# Altium project PCB_Project.PrjPcb
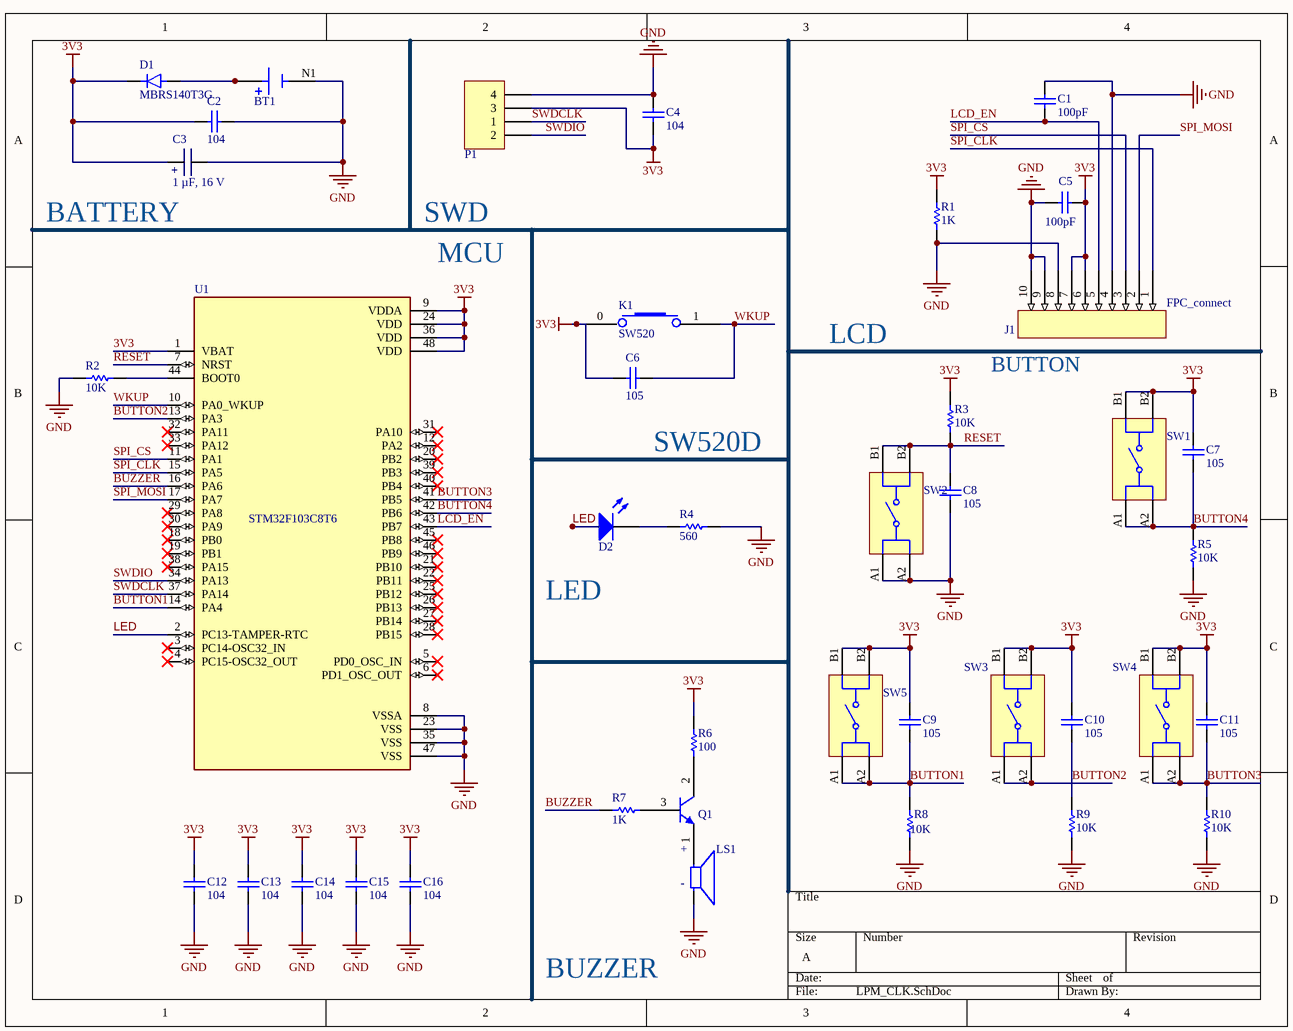
[diagram p0: LPM_CLK.SchDoc]
1 sheet, 40 parts. Net scope: global (net labels, ports and power ports of the same name join across sheets).
Board file: LPM_CLK.PcbDoc

## Sheet LPM_CLK.SchDoc
size A; SheetNumber: 1; SheetTotal: 1

### Parts
BT1  BAT-HLD-001  [BAT_BAT-HLD-001]  (value not drawn)
C1  value 100pF  [CAP-SM-0805]  (hidden comment: Cap Non-Pol SMD)
C2  value 104  [CAP-SM-0805]  (hidden comment: Cap Non-Pol SMD)
C3  1 µF, 16 V  [TANTALUM SMD A]
C4  value 104  [CAP-SM-0805]  (hidden comment: Cap Non-Pol SMD)
C5  value 100pF  [CAP-SM-0805]  (hidden comment: Cap Non-Pol SMD)
C6  value 105  [CAP-SM-0805]  (hidden comment: Cap Non-Pol SMD)
C7  value 105  [CAP-SM-0805]  (hidden comment: Cap Non-Pol SMD)
C8  value 105  [CAP-SM-0805]  (hidden comment: Cap Non-Pol SMD)
C9  value 105  [CAP-SM-0805]  (hidden comment: Cap Non-Pol SMD)
C10  value 105  [CAP-SM-0805]  (hidden comment: Cap Non-Pol SMD)
C11  value 105  [CAP-SM-0805]  (hidden comment: Cap Non-Pol SMD)
C12  value 104  [CAP-SM-0805]  (hidden comment: Cap Non-Pol SMD)
C13  value 104  [CAP-SM-0805]  (hidden comment: Cap Non-Pol SMD)
C14  value 104  [CAP-SM-0805]  (hidden comment: Cap Non-Pol SMD)
C15  value 104  [CAP-SM-0805]  (hidden comment: Cap Non-Pol SMD)
C16  value 104  [CAP-SM-0805]  (hidden comment: Cap Non-Pol SMD)
D1  MBRS140T3G  [DIOM5435X247N]
D2  LED SMD  [LED_0603_Blue]  (value not drawn)
J1  FPC_connect  [FPC_connect]
K1  SW520  [SW520D]
LS1  CMT-7525-80-SMT-TR  [XDCR_CMT-7525-80-SMT-TR]  (value not drawn)
P1  Header 4H  [JP4H]  (value not drawn)
Q1  C1815  [SOT23B]  (value not drawn)
R1  value 1K  [RES-SM-0603]  (hidden comment: RESISTOR SMD)
R2  value 10K  [RES-SM-0603]  (hidden comment: RESISTOR SMD)
R3  value 10K  [RES-SM-0603]  (hidden comment: RESISTOR SMD)
R4  value 560  [RES-SM-0603]  (hidden comment: RESISTOR SMD)
R5  value 10K  [RES-SM-0603]  (hidden comment: RESISTOR SMD)
R6  value 100  [RES-SM-0603]  (hidden comment: RESISTOR SMD)
R7  value 1K  [RES-SM-0603]  (hidden comment: RESISTOR SMD)
R8  value 10K  [RES-SM-0603]  (hidden comment: RESISTOR SMD)
R9  value 10K  [RES-SM-0603]  (hidden comment: RESISTOR SMD)
R10  value 10K  [RES-SM-0603]  (hidden comment: RESISTOR SMD)
SW1  430451035836  [WS-TASV_L6W6H3.5_4304x10358x6]  (value not drawn)
SW2  430451035836  [WS-TASV_L6W6H3.5_4304x10358x6]  (value not drawn)
SW3  430451035836  [WS-TASV_L6W6H3.5_4304x10358x6]  (value not drawn)
SW4  430451035836  [WS-TASV_L6W6H3.5_4304x10358x6]  (value not drawn)
SW5  430451035836  [WS-TASV_L6W6H3.5_4304x10358x6]  (value not drawn)
U1  STM32F103C8T6  [QFP50P900X900X160-48N]

### Nets
3V3: C2.1 C3.2 C4.1 C5.1 C6.2 C7.2 C9.2 C10.2 C11.2 C12.2 C13.1 C14.2 C15.2 C16.2 D1.1(C) J1.6 J1.7 K1.0(+) P1.3 R1.2 R3.2 R6.2 SW1.B1 SW1.B2 SW3.B1 SW3.B2 SW4.B1 SW4.B2 SW5.B1 SW5.B2 U1.1(VBAT) U1.9(VDDA) U1.24(VDD) U1.36(VDD) U1.48(VDD)
GND: BT1.N1(NEG) C1.1 C2.2 C3.1 C4.2 C5.2 C8.1 C12.1 C13.2 C14.1 C15.1 C16.1 J1.4 J1.8 J1.9 J1.10 LS1.N P1.4 R1.1 R2.1 R4.2 R5.1 R8.1 R9.1 R10.1 SW2.A1 SW2.A2 U1.8(VSSA) U1.23(VSS) U1.35(VSS) U1.47(VSS)
BUTTON1: C9.1 R8.2 SW5.A1 SW5.A2 U1.14(PA4)
BUTTON2: C10.1 R9.2 SW3.A1 SW3.A2 U1.13(PA3)
BUTTON3: C11.1 R10.2 SW4.A1 SW4.A2 U1.41(PB5)
BUTTON4: C7.1 R5.2 SW1.A1 SW1.A2 U1.42(PB6)
BUZZER: R7.1 U1.16(PA6)
LCD_EN: C1.2 J1.5 U1.43(PB7)
LED: D2.1(A) U1.2(PC13-TAMPER-RTC)
RESET: C8.2 R3.1 SW2.B1 SW2.B2 U1.7(NRST)
SPI_CLK: J1.1 U1.15(PA5)
SPI_CS: J1.3 U1.11(PA1)
SPI_MOSI: J1.2 U1.17(PA7)
SWDCLK: P1.1 U1.37(PA14)
SWDIO: P1.2 U1.34(PA13)
WKUP: C6.1 K1.1(-) U1.10(PA0_WKUP)
NetBT1_P1: BT1.P1(POS) BT1.P2(POS) D1.2(A)
NetD2_2: D2.2(K) R4.1
NetLS1_P: LS1.P Q1.1(E)
NetQ1_2: Q1.2(C) R6.1
NetQ1_3: Q1.3(B) R7.2
NetR2_2: R2.2 U1.44(BOOT0)

Not connected (* = marked no-connect by the designer): U1 3(PC14-OSC32_IN)* 4(PC15-OSC32_OUT)* 5(PD0_OSC_IN)* 6(PD1_OSC_OUT)* 12(PA2)* 18(PB0)* 19(PB1)* 20(PB2)* 21(PB10)* 22(PB11)* 25(PB12)* 26(PB13)* 27(PB14)* 28(PB15)* 29(PA8)* 30(PA9)* 31(PA10)* 32(PA11)* 33(PA12)* 38(PA15)* 39(PB3)* 40(PB4)* 45(PB8)* 46(PB9)*

### Notes on the sheet
- (near C3) BATTERY
- SWD
- (near U1) MCU
- LCD
- BUTTON
- SW520D
- (near D2) LED
- BUZZER
- (in symbol 01120610510) +
- (in symbol CMT-7525-80-SMT-TR) +; -

### Library data of the parts
BT1 = BAT-HLD-001: Battery Retainer Coin, 20.0mm 1 Cell SMD (SMT) Tab; Value: *; MP: BAT-HLD-001; Package: None; Availability: Unavailable; Price: None
C1 C2 C4-C16 = Cap Non-Pol SMD: Capacitor
C3 = 01120610510: CAP TANT 1uF 10% 16V 1206; Manufacture  Name: KYOCERA AVX; Manufacture  SN: TAJA105K016RNJ; Capacitance Tolerance: +/-10%; ComponentLink1Description: Datasheet link; ComponentLink1URL: https://datasheets.kyocera-avx.com/TAJ.pdf; ComponentLink2Description: Supplier 1 URL; ComponentLink2URL: https://www.mouser.vn/ProductDetail/KYOCERA-AVX/TAJA105K016RNJ?qs=OVpPYgiJXXWzOIbDvQCr4Q%3D%3D; Size: 1206; Mounting Technology: SMT; Capacitance: 1uF; ComponentLink3Description: Supplier 2 URL; ComponentLink3URL: https://www.digikey.com/en/products/detail/kyocera-avx/TAJA105K016RNJ/563757; ComponentLink4Description: Supplier 3 URL; ComponentLink4URL: https://www.thegioiic.com/tu-tantalum-1uf-16v-1206-taja105k016rnj; Supplier 1 Name: Mouser; Supplier 1 SN: 581-TAJA105K016; Supplier 1 URL: https://www.mouser.vn/ProductDetail/KYOCERA-AVX/TAJA105K016RNJ?qs=OVpPYgiJXXWzOIbDvQCr4Q%3D%3D; Supplier 2 Name: Digi-Key; Supplier 2 SN: 478-1649-1-ND; Supplier 2 URL: https://www.digikey.com/en/products/detail/kyocera-avx/TAJA105K016RNJ/563757; Supplier 3 Name: thegioiic; Supplier 3 SN: N/A; Supplier 3 URL: https://www.thegioiic.com/tu-tantalum-1uf-16v-1206-taja105k016rnj; Value: 1 µF, 16 V; Rated Voltage: 16 V
D2 = LED SMD: LED
K1 = SW520D
LS1 = CMT-7525-80-SMT-TR: 7.5 mm, 3.6 Vo-p, 80 dB, Surface Mount (SMT), Magnetic Audio Transducer Buzzer; MF: CUI Devices; Value: *; Digi-Key_Part_Number: 102-CMT-7525-80-SMT-TR-ND; SnapEDA_Link: https://www.snapeda.com/parts/CMT-7525-80-SMT-TR/CUI+Devices/view-part/?ref=snap; Check_prices: https://www.snapeda.com/parts/CMT-7525-80-SMT-TR/CUI+Devices/view-part/?ref=eda; CUI_purchase_URL: https://www.cuidevices.com/product/audio/buzzers/audio-transducers/cmt-7525-80-smt-tr?utm_source=snapeda.com&utm_medium=referral&utm_campaign=snapedaBOM; Purchase-URL: https://pricing.snapeda.com/search/part/CMT-7525-80-SMT-TR/?ref=eda; Package: CUI Devices; MP: CMT-7525-80-SMT-TR
P1 = Header 4H: Header, 4-Pin, Right Angle; LatestRevisionDate: 17-Jul-2002; LatestRevisionNote: Re-released for DXP Platform.; Publisher: Altium Limited
Q1 = C1815: NPN Bipolar Transistor
R1-R10 = RESISTOR SMD: Resistor
SW1-SW5 = 430451035836: WS-TASV SMT Washable Tact Switch, L6 x W6 x H3.5mm, 360g, SPST-NO, 12V, 50mA; Manufacturer: Wurth Elektronik; Washable: Yes; Rated Voltage: 12VDC; Manufacturer Part Number: 430451035836; Category: Tact Switches; Match Code: WS-TASV; ComponentLink2Description: Datasheet Link; ComponentLink2URL: https://www.we-online.com/redexpert/spec/430451035836?ad; Mount: Surface Mount; Operating Temperature Max: 85°C; Operating Temperature Min: -40°C; Packaging: Tape and Reel; Length: 6mm; Width: 6mm; Height: 3.5mm; Circuit: SPST-NO; Contact Material: Stainless Steel; Operation Force: 360g; Rated Current: 50mA; Terminal Material: Brass; Terminal Plating: Silver; Supplier 1 Name: Mouser; Supplier 1 SN: 710-430451035836; Supplier 1 URL: https://www.mouser.vn/ProductDetail/Wurth-Elektronik/430451035836?qs=wr8lucFkNMVsx4f3WHCAuQ%3D%3D; Supplier 2 Name: Digi-Key; Supplier 2 SN: 732-7012-2-ND; Supplier 2 URL: https://www.digikey.com/en/products/detail/w%C3%BCrth-elektronik/430451035836/5209030; Supplier 3 Name: Thegioiic; Supplier 3 SN: N/A; Supplier 3 URL: https://www.thegioiic.com/nut-nhan-6x6mm-cao-3-4mm-4-chan-smd-dau-do
U1 = STM32F103C8T6: ARMÂ® CortexÂ®-M3 STM32F1 Microcontroller IC 32-Bit 72MHz 64KB (64K x 8) FLASH 48-LQFP (7x7); MF: STMicroelectronics; Package: LQFP-48 STMicroelectronics; Price: None; Check_prices: https://www.snapeda.com/parts/STM32F103C8T6/STMicroelectronics/view-part/?ref=eda; Value: *; SnapEDA_Link: https://www.snapeda.com/parts/STM32F103C8T6/STMicroelectronics/view-part/?ref=snap; MP: STM32F103C8T6; Availability: In Stock; Purchase-URL: https://pricing.snapeda.com/search/part/STM32F103C8T6/?ref=eda
D1 = MBRS140T3G: Price: None; Availability: Unavailable; Package: None; MP: MBRS140T3G; Value: *